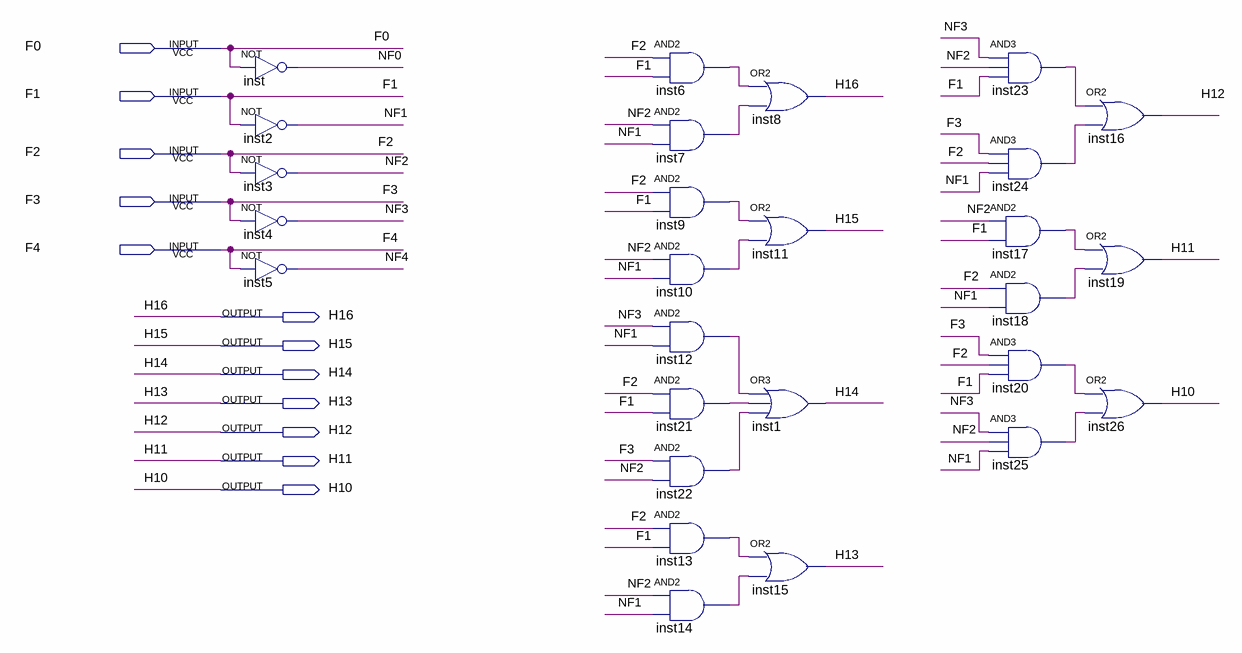
[diagram p0: schematic sheet]
// Quartus schematic DecodificadorHEX1.bdf as structural Verilog: 27 symbols, 12 pins
module DecodificadorHEX1 (
  input  F0,
  input  F1,
  input  F2,
  input  F3,
  input  F4,
  output H16,
  output H15,
  output H14,
  output H13,
  output H12,
  output H11,
  output H10
);

  wire inst6_out, inst7_out, inst9_out, inst10_out, inst12_out, inst13_out, inst14_out, inst17_out,
       inst18_out, inst20_out, inst21_out, inst22_out, inst23_out, inst24_out, inst25_out, NF0, NF1, NF2,
       NF3, NF4;

  not inst (NF0, F0);
  not inst2 (NF1, F1);
  not inst3 (NF2, F2);
  not inst4 (NF3, F3);
  not inst5 (NF4, F4);
  and inst6 (inst6_out, F2, F1);
  and inst7 (inst7_out, NF2, NF1);
  and inst9 (inst9_out, F2, F1);
  and inst10 (inst10_out, NF2, NF1);
  and inst12 (inst12_out, NF3, NF1);
  and inst21 (inst21_out, F2, F1);
  and inst22 (inst22_out, F3, NF2);
  and inst13 (inst13_out, F2, F1);
  and inst14 (inst14_out, NF2, NF1);
  or inst8 (H16, inst6_out, inst7_out);
  or inst11 (H15, inst9_out, inst10_out);
  or inst1 (H14, inst12_out, inst21_out, inst22_out);
  or inst15 (H13, inst13_out, inst14_out);
  and inst23 (inst23_out, NF3, NF2, F1);
  and inst24 (inst24_out, F3, F2, NF1);
  and inst17 (inst17_out, NF2, F1);
  and inst18 (inst18_out, F2, NF1);
  and inst20 (inst20_out, F3, F2, F1);
  and inst25 (inst25_out, NF3, NF2, NF1);
  or inst16 (H12, inst23_out, inst24_out);
  or inst19 (H11, inst17_out, inst18_out);
  or inst26 (H10, inst20_out, inst25_out);
endmodule
